# EAGLE design dimmer microcontrolado (EAGLE 9.6.0)
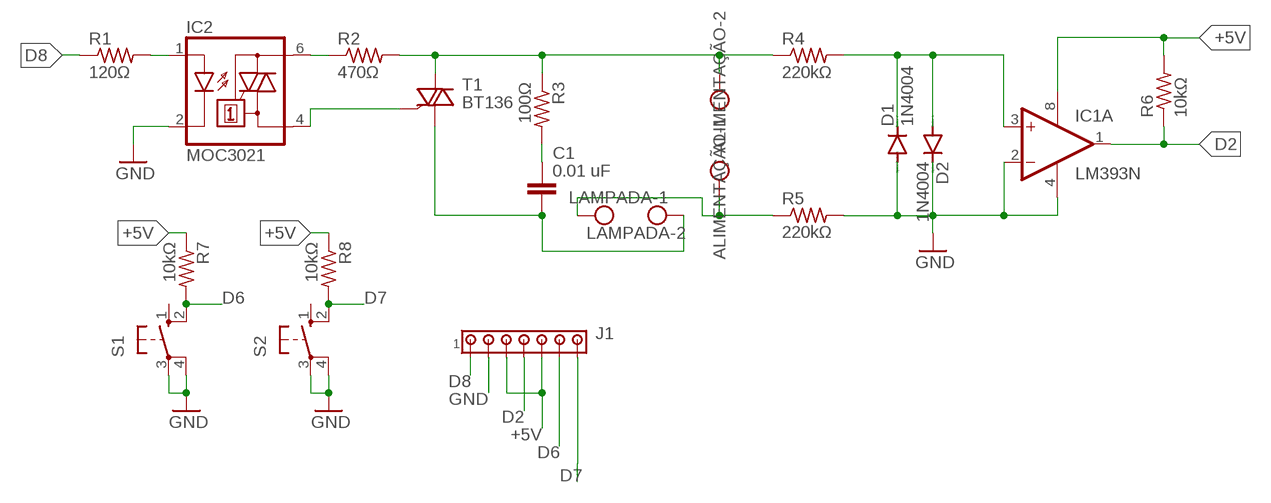
[diagram p0: schematic, sheet 1]

## Parts
ALIMENTAÇÃO  AK300/2  [AK300/2]
C1  0.01 uF  C-EU075-032X103  [C075-032X103]
D1  1N4004  1N4148DO35-7  [DO35-7]
D2  1N4004  1N4148DO35-7  [DO35-7]
IC1  LM393N  [DIL08]
IC2  MOC3021  MOC3021M  [DIL06]
J1  MTA07-100  [10X07MTA]
LAMPADA  AK300/2  [AK300/2]
R1  120Ω  R-US_0207/10  [0207/10]
R2  470Ω  R-US_0207/10  [0207/10]
R3  100Ω  R-US_0207/10  [0207/10]
R4  220kΩ  R-US_0207/10  [0207/10]
R5  220kΩ  R-US_0207/10  [0207/10]
R6  10kΩ  R-US_0207/10  [0207/10]
R7  10kΩ  R-US_0207/10  [0207/10]
R8  10kΩ  R-US_0207/10  [0207/10]
S1  10-XX  [B3F-10XX]
S2  10-XX  [B3F-10XX]
T1  BT136  [TO220AB]

## Nets
+5V: IC1.8(P:V+) J1.3 J1.5 R6.2 R7.1 R8.1
D2: IC1.1(A:OUT) J1.4 R6.1
D6: J1.6 R7.2 S1.2(S1)
D7: J1.7 R8.2 S2.2(S1)
D8: J1.1 R1.1
GND: D1.A D2.C IC1.2(A:-IN) IC1.4(P:V-) IC2.2(C) J1.2 R5.2 S1.3(P) S1.4(P1) S2.3(P) S2.4(P1)
N$10: IC2.1(A) R1.2
N$11: IC2.6(A2) R2.1
N$12: C1.1 R3.2
N$13: IC2.4(A1) T1.3(G)
N$14: ALIMENTAÇÃO.1 R2.2 R3.1 R4.1 T1.2(A2)
N$15: C1.2 LAMPADA.2 T1.1(A1)
N$16: ALIMENTAÇÃO.2 LAMPADA.1 R5.1
N$18: D1.C D2.A IC1.3(A:+IN) R4.2
Unconnected: IC1.5(B:+IN) IC1.6(B:-IN) IC1.7(B:OUT) S1.1(S) S2.1(S)

## Library data of the parts
ALIMENTAÇÃO LAMPADA = con-ptr500:AK300/2: CONNECTOR; OC_FARNELL: unknown; OC_NEWARK: unknown
C1 = rcl:C-EU: CAPACITOR, European symbol; SPICEPREFIX: C
D1 D2 = diode:1N4148: DIODE high speed (Philips)
IC1 = linear:LM393: COMPARATOR
IC2 = optocoupler:MOC30*M: RANDOM-PHASE OPTOISOLATORS TRIAC DRIVER OUTPUT Source: http://www.fairchildsemi.com MOC3020-M.pdf; MF: FAIRCHILD SEMICONDUCTOR; MPN: MOC3021-M; OC_FARNELL: 1021365; OC_NEWARK: 95B7895
J1 = con-amp:MTA07-100: AMP connector
R1-R8 = rcl:R-US_: RESISTOR, American symbol; SPICEPREFIX: R
S1 S2 = switch-omron:10-XX: OMRON SWITCH; MPN: B3F-1000; OC_FARNELL: 176432; OC_NEWARK: 36M3542
T1 = triac:BT136: Triac BT136 series E sensitive gate Source: http://www.nxp.com/acrobat_download/datasheets/BT136_SERIES_E_2.pdf

## Board
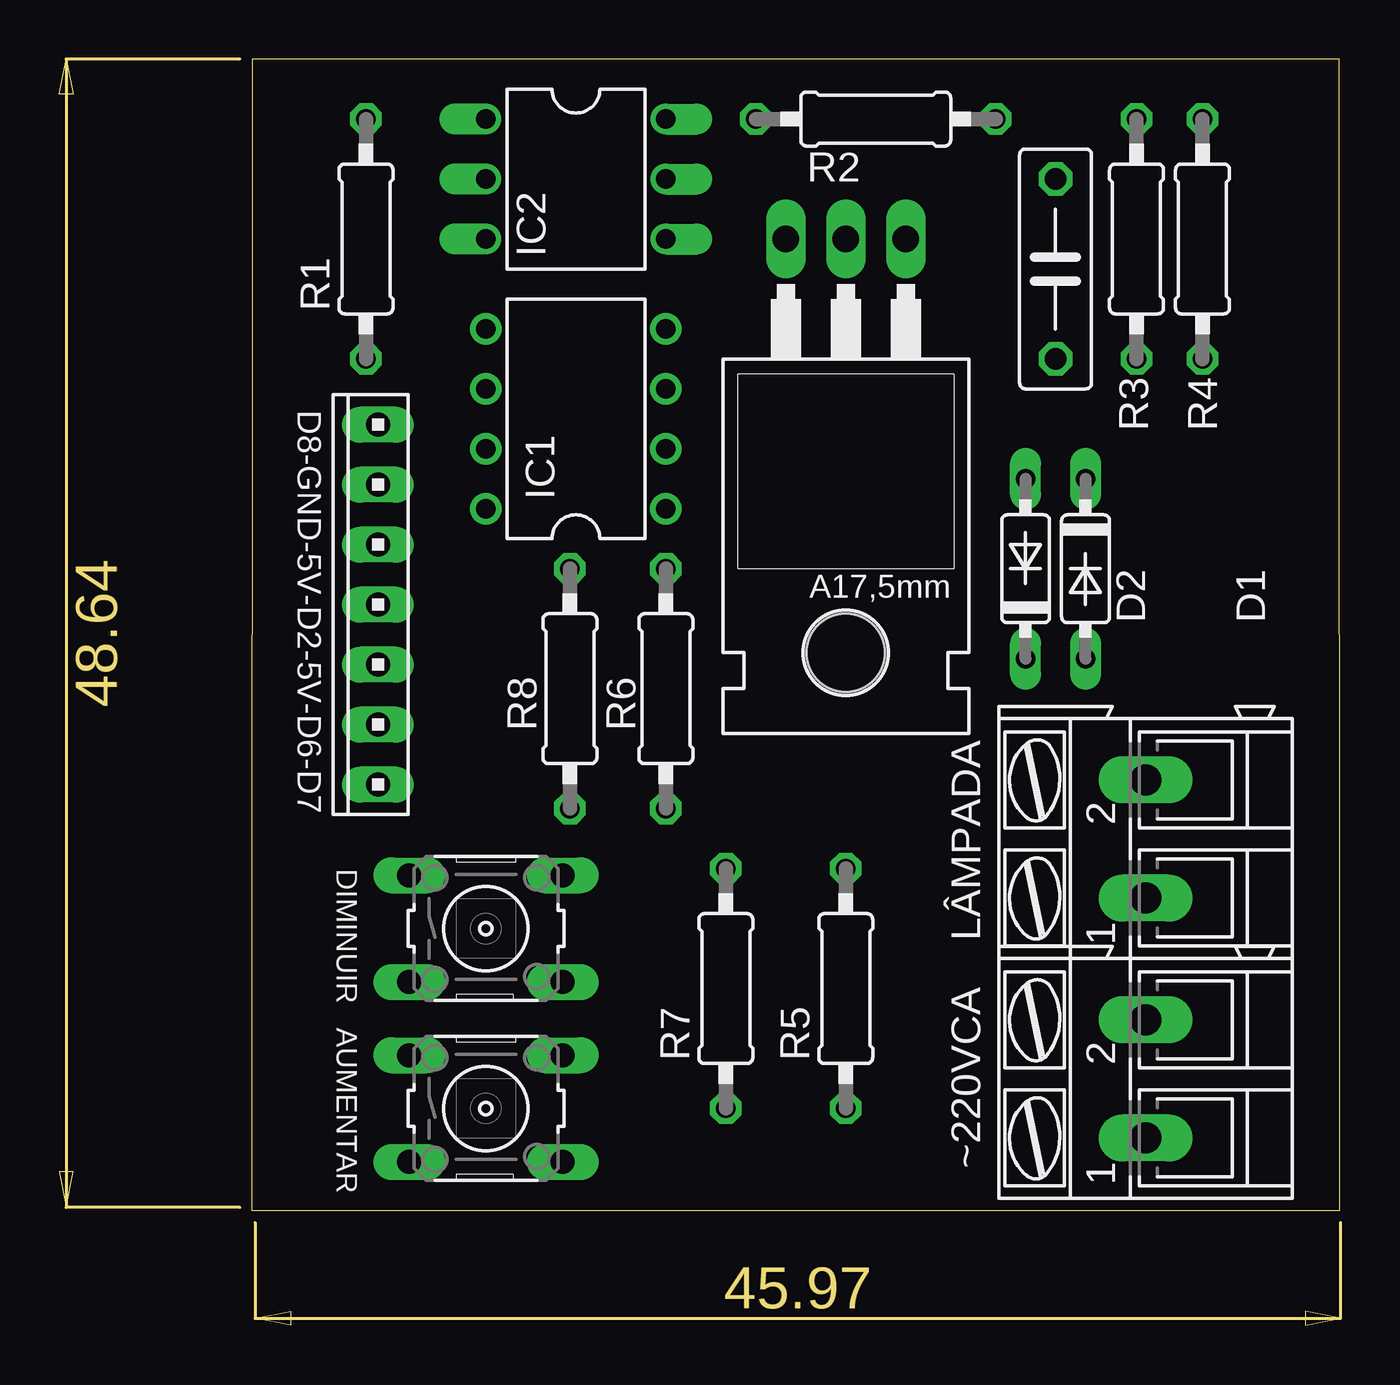
[diagram p1: board, top side]
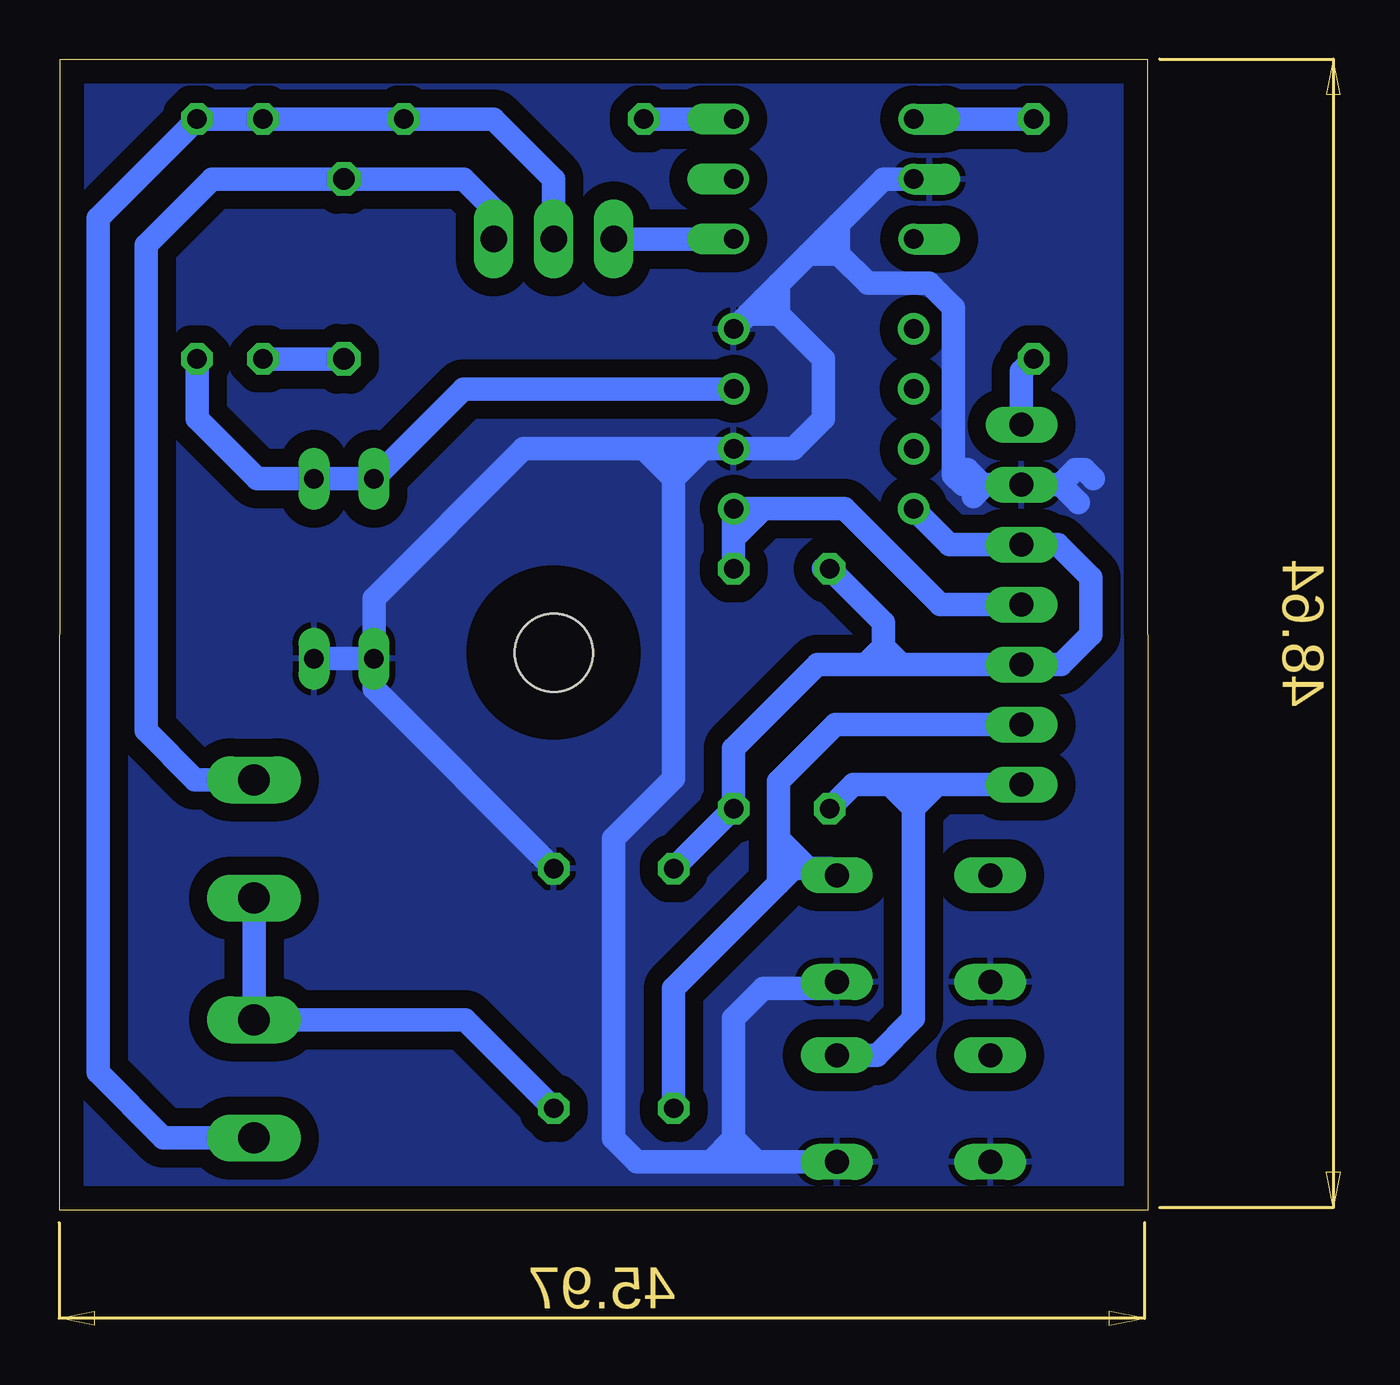
[diagram p2: board, bottom side, seen from below]

Size 46.1 x 48.76 mm. Coordinates in mm from the lower left corner, seen from the top.
Outline: 0,0 46.1,0 46.08,48.76 0.03,48.76 0,0
Copper layers (1*16): Top 0.035mm / dielectric 1.5mm / Bottom 0.035mm
Design rules "default *": minimum track width 6mil, minimum drill 0.35mm, track to track 6mil, track to pad 6mil, pad to pad 6mil, via to via 6mil, smd to smd 6mil, copper to edge 40mil, drill to drill 6mil, minimum pad ring 10mil, minimum via ring 8mil, stop-mask expansion 4mil, vias tented up to drill 0mil, thermal gap 10mil

### Footprints (pad centres in the part's own frame; a part is rotated, then mirrored left to right if it is on the bottom)
AK300/2 = drill 1.321 long: 1 -2.515,0; 2 2.489,0
C075-032X103 = drill 0.914 octagon: 1 -3.81,0; 2 3.81,0
DO35-7 = drill 0.813 long: A 3.81,0; C -3.81,0
DIL08 = drill 0.813 pad 1.27: 1 -3.81,-3.81; 2 -1.27,-3.81; 3 1.27,-3.81; 4 3.81,-3.81; 5 3.81,3.81; 6 1.27,3.81; 7 -1.27,3.81; 8 -3.81,3.81
DIL06 = drill 0.813 offset: 1 -2.54,-3.81; 2 0,-3.81; 3 2.54,-3.81; 4 2.54,3.81; 5 0,3.81; 6 -2.54,3.81
10X07MTA = drill 1.016 long: 1 7.62,0; 2 5.08,0; 3 2.54,0; 4 0,0; 5 -2.54,0; 6 -5.08,0; 7 -7.62,0
0207/10 = drill 0.813 octagon: 1 -5.08,0; 2 5.08,0
B3F-10XX = drill 1.016 long: 1 -3.251,2.261; 2 3.251,2.261; 3 -3.251,-2.261; 4 3.251,-2.261
TO220AB = drill 1.118 long: 1 -2.54,-6.35; 2 0,-6.35; 3 2.54,-6.35 | hole 3.302: 0,11.176

### Placement (x,y rotation side)
ALIMENTAÇÃO  37.87,5.59 90 top
C1  34.06,39.88 90 top
D1  35.33,27.18 270 top
D2  32.79,27.18 90 top
IC1  13.74,33.53 90 top
IC2  13.74,43.69 270 top
J1  5.36,25.65 90 top
LAMPADA  37.87,15.75 90 top
R1  4.85,41.15 90 top
R2  26.44,46.23 0 top
R3  37.49,41.15 270 top
R4  40.29,41.15 270 top
R5  25.17,9.4 90 top
R6  17.55,22.1 270 top
R7  20.09,9.4 270 top
R8  13.49,22.1 270 top
S1  9.93,11.94 0 top
S2  9.93,4.32 0 top
T1  25.17,34.8 180 top

### Tracks (layer width: path | path; a pad name or v marks a point on that pad's centre or on a via)
+5V
  Bottom 1: R7.1 R6.2 17.55,19.56 14,23.11 11.96,23.11 | 13.74,27.18 R8.1 11.2,24.89 11.2,23.88 | IC1.8 8.41,28.19 J1.3 3.83,28.19 2.43,26.8 2.43,24.38 3.7,23.11 J1.5 10.44,23.11 | 10.44,23.11 11.2,23.11 | 11.2,23.11 11.96,23.11 | 11.2,23.11 11.2,23.88 | 10.44,23.11 11.2,23.88 | 11.2,23.88 11.96,23.11
D2
  Bottom 1: 17.55,28.45 IC1.1 16.28,29.72 | 17.55,28.45 R6.1 | 16.28,29.72 12.85,29.72 8.79,25.65 J1.4 | 17.55,28.45 16.28,29.72
D6
  Bottom 1: R7.2 20.09,9.4 15.65,13.84 | J1.6 13.23,20.57 15.65,18.16 15.65,15.75 | 15.65,13.84 15.01,14.48 13.46,14.48 S1.2 14.1,14.2 15.65,15.75 | 15.65,15.75 15.65,13.84
D7
  Bottom 1: S2.2 11.48,6.58 9.93,8.13 9.93,17.02 | R8.2 12.47,18.03 11.2,18.03 10.95,18.03 | J1.7 8.92,18.03 | 8.92,18.03 9.93,18.03 | 9.93,18.03 10.95,18.03 | 9.93,18.03 9.93,17.02 | 8.92,18.03 9.93,17.02 | 9.93,17.02 10.95,18.03
D8
  Bottom 1: R1.1 5.36,35.56 J1.1
GND
  Bottom 1: IC2.2 11.2,43.69 13.11,41.78 | IC1.4 16.92,37.97 | 16.92,37.97 16.28,38.61 | 16.28,38.61 15.65,39.24 | 15.65,39.24 14.38,40.51 | 14.38,40.51 13.74,41.15 | 13.74,41.15 13.11,41.78 | 15.65,37.97 13.74,36.07 13.74,33.53 15.01,32.26 IC1.2 18.82,32.26 | 15.65,39.24 15.65,37.97 | 16.28,38.61 15.65,37.97 | 15.65,37.97 16.92,37.97 | 18.82,32.26 20.09,32.26 | 20.09,32.26 21.36,32.26 | 21.36,32.26 26.44,32.26 32.79,25.91 D2.C | 20.09,32.26 20.09,30.99 | 20.09,30.99 20.09,18.29 22.63,15.75 22.63,3.05 21.64,2.06 18.54,2.06 | 18.82,32.26 20.09,30.99 | 20.09,30.99 21.36,32.26 | 9.27,39.27 8.25,38.24 8.25,31.15 7.83,30.73 7.39,30.73 7.65,30.99 7.65,31.37 7.01,30.73 J1.2 | 9.27,39.27 9.29,39.28 | 13.11,40.51 11.86,39.27 9.27,39.27 | 13.11,40.51 13.74,41.15 | 13.11,40.51 14.38,40.51 | 13.11,41.78 13.11,40.51 | 18.54,2.06 17.55,2.06 | 17.55,2.06 16.56,2.06 | 16.56,2.06 S2.4 | S1.4 13.46,9.4 16.28,9.4 17.55,8.13 17.55,3.05 | 17.55,3.05 17.55,2.06 | 17.55,3.05 16.56,2.06 | 17.55,3.05 18.54,2.06 | D1.A D2.C | R5.2 32.79,22.1 D2.C | 3.71,30.73 2.95,29.97 | J1.2 3.71,30.73 | 3.71,30.73 3.07,31.37 2.69,31.37 2.31,30.99 | J1.2 6.88,30.73 7.39,30.23
  pour Bottom (isolate 0.762): 0.03,48.77 46,48.77 46,0 0.03,0
N$10
  Bottom 1: R1.2 IC2.1
N$11
  Bottom 1: IC2.6 R2.1
N$12
  Bottom 1: C1.1 R3.2
N$13
  Bottom 1: T1.3 IC2.4
N$14
  Bottom 1: T1.2 25.17,43.69 27.71,46.23 R2.2 R3.1 R4.1 44.48,42.04 44.48,5.84 41.71,3.07 ALIMENTAÇÃO.1
N$15
  Bottom 1: T1.1 27.71,42.42 28.98,43.69 C1.2 39.65,43.69 42.44,40.89 42.44,20.32 40.36,18.24 LAMPADA.2
N$16
  Bottom 1: R5.1 28.93,8.08 ALIMENTAÇÃO.2 LAMPADA.1
N$18
  Bottom 1: R4.2 40.29,33.53 37.75,30.99 D1.C D2.A 28.98,34.8 IC1.3

### Text on the board
tNames: D8-GND-5V-D2-5V-D6-D7 | DIMINUIR | LÂMPADA | AUMENTAR | ~220VCA